# Altium project 2_Smoke_detector.PrjPcb (part 6 of 6)
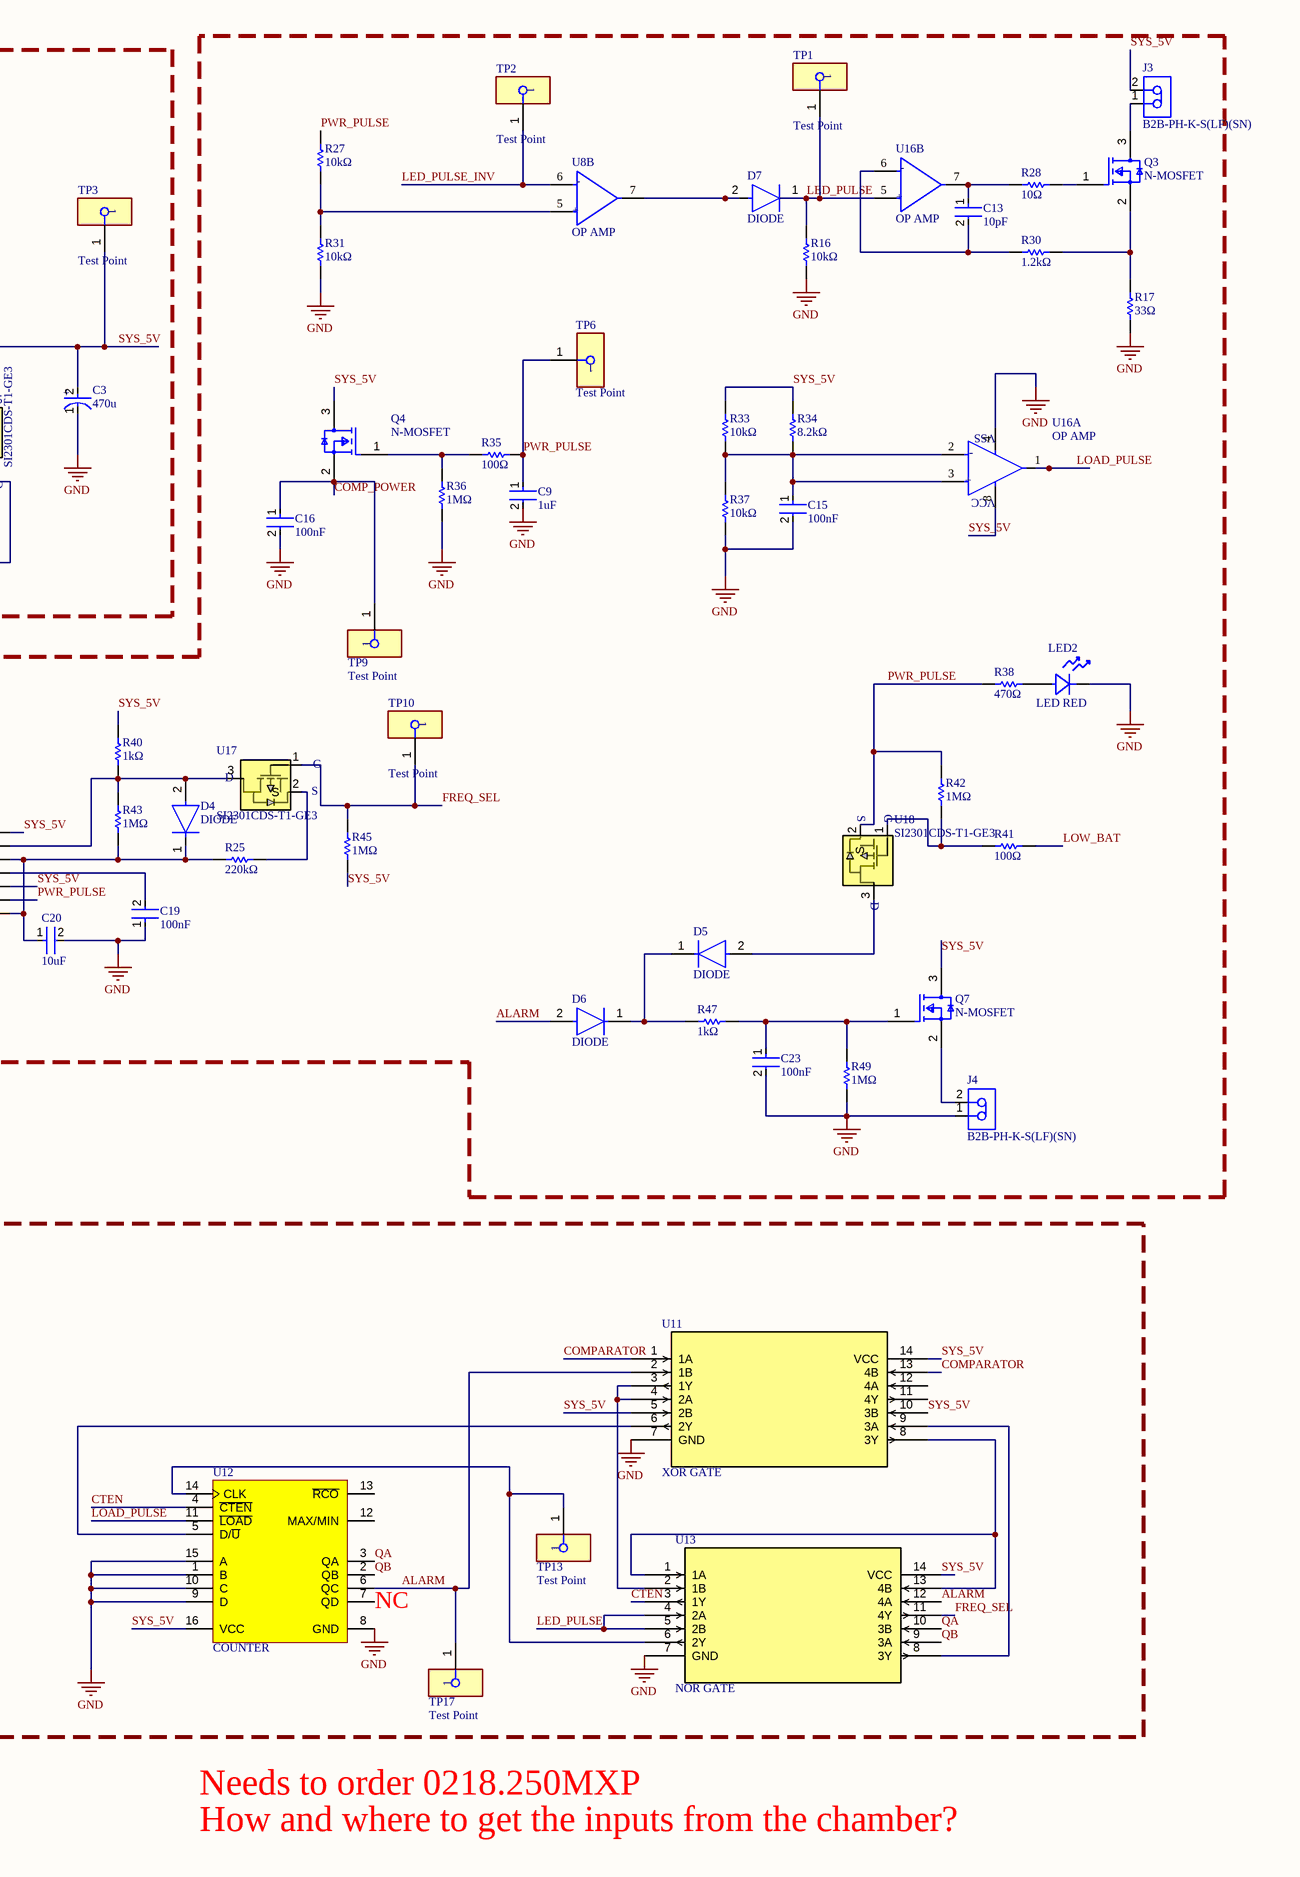
[diagram p6: 2_Smoke_detector.SchDoc, right]

## Sheet 2_Smoke_detector.SchDoc (continued)

### Library data of the parts (continued)
U12 = SN74HC191DR: IC BINARY COUNTER 4-BIT 16SOIC; Manufacturer: Texas Instruments; Manufacturer Lifecycle Status: ACTIVE; Clock Edge Trigger Type: Positive Edge; Direction: Bidirectional; Frequency: 48MHz; Max Supply Voltage: 6V; Min Supply Voltage: 2V; Number of Bits: 4; Number of Elements: 1; Operating Supply Voltage: 5V; Propagation Delay: 330ns; Sync/Async: Synchronous; Parameter 1: C484752; Supplier: Arrow Electronics; Supplier Part Number: C484752; Manufacturer Part Number: SN74HC191DR; RoHS: Compliant; Category: Counters; Stock: 558; Pricing: 1=0.3109, 10=0.3077, 25=0.3045, 100=0.3012, 250=0.298, 500=0.2948 (USD); Case/Package: SOIC; Height: 1.75mm; Lead Free: Lead Free; Length: 9.9mm; Lifecycle Status: Production; Logic Function: Counter; Max Operating Temperature: 85°C; Min Operating Temperature: -40°C; Mounting Technology: Surface Mount; Number of Bits per Element: 4; Pins: 16; Radiation Hardening: No; Schedule B: 8542390000, 8542390000|8542390000|8542390000|8542390000|8542390000; Thickness: 1.58mm; Turn-On Delay Time: 330ns; Weight: 141.690917mg; Width: 3.91mm; ComponentLink1URL: https://datasheet.octopart.com:443/SN74HC191DR-Texas-Instruments-datasheet-33033771.pdf?src-supplier=Texas+Instruments; ComponentLink1Description: https://datasheet.octopart.com:443/SN74HC191DR-Texas-Instruments-datasheet-33033771.pdf?src-supplier=Texas+Instruments; ComponentLink2URL: https://octopart.com:443/opatz8j6/c1?t=livQ8q43hWssvsTbIukJTl-bIiZFqHZ0_eG3ZISHFBGsaXj-6bBEoDG3PlwY2extO-X4vpm_CU7QLECDmgYzLGckRBw-Kbj8krgv4rmDK5yCwmDJ3CNVrP-qwPYpI0C_npVjETDCSzGdwJl8AedVD4--R_M23QxTnmHvlW1ezJkcgh_L1X-WuZU7RjpO56SQ3Zy_2CfdvVUvgApZvWencagwVo7xUZlWYvKblZWRwPqoRaIW_0nKcn1YlJgtddRiOWr6k4nRbeS5A28F22AkvDGS5XTih2WxDgVJofo11MXYRBHOIIfl1zg_UGo2ZSsVug4JVBZftDOiZiHXpjFkYXXcMh70ddjpxIu2AbTHTmViyoSqUNmmygbjeYWlvFqXFwPzDA&src-supplier=Texas+Instruments; ComponentLink2Description: https://octopart.com:443/opatz8j6/c1?t=livQ8q43hWssvsTbIukJTl-bIiZFqHZ0_eG3ZISHFBGsaXj-6bBEoDG3PlwY2extO-X4vpm_CU7QLECDmgYzLGckRBw-Kbj8krgv4rmDK5yCwmDJ3CNVrP-qwPYpI0C_npVjETDCSzGdwJl8AedVD4--R_M23QxTnmHvlW1ezJkcgh_L1X-WuZU7RjpO56SQ3Zy_2CfdvVUvgApZvWencagwVo7xUZlWYvKblZWRwPqoRaIW_0nKcn1YlJgtddRiOWr6k4nRbeS5A28F22AkvDGS5XTih2WxDgVJofo11MXYRBHOIIfl1zg_UGo2ZSsVug4JVBZftDOiZiHXpjFkYXXcMh70ddjpxIu2AbTHTmViyoSqUNmmygbjeYWlvFqXFwPzDA&src-supplier=Texas+Instruments; ComponentLink3URL: https://datasheet.octopart.com:443/SN74HC191DR-Texas-Instruments-datasheet-10254193.pdf?src-supplier=Texas+Instruments; ComponentLink3Description: https://datasheet.octopart.com:443/SN74HC191DR-Texas-Instruments-datasheet-10254193.pdf?src-supplier=Texas+Instruments; ComponentLink4URL: https://sigma.octopart.com:443/49249801/technical_drawing/Texas-Instruments-SN74HC191DR.pdf?src-supplier=Texas+Instruments; ComponentLink4Description: https://sigma.octopart.com:443/49249801/technical_drawing/Texas-Instruments-SN74HC191DR.pdf?src-supplier=Texas+Instruments; ComponentLink5URL: https://datasheet.octopart.com:443/SN74HC191DR-Texas-Instruments-datasheet-10253684.pdf?src-supplier=Texas+Instruments; ComponentLink5Description: https://datasheet.octopart.com:443/SN74HC191DR-Texas-Instruments-datasheet-10253684.pdf?src-supplier=Texas+Instruments; ComponentLink6URL: https://datasheet.octopart.com:443/SN74HC191DR-Texas-Instruments-datasheet-149727.pdf?src-supplier=Mouser; ComponentLink6Description: https://datasheet.octopart.com:443/SN74HC191DR-Texas-Instruments-datasheet-149727.pdf?src-supplier=Mouser; ComponentLink7URL: https://datasheet.octopart.com:443/SN74HC191DR-Texas-Instruments-datasheet-11538999.pdf?src-supplier=HQonline; ComponentLink7Description: https://datasheet.octopart.com:443/SN74HC191DR-Texas-Instruments-datasheet-11538999.pdf?src-supplier=HQonline; ComponentLink8URL: https://datasheet.octopart.com:443/SN74HC191DR-Texas-Instruments-datasheet-165804434.pdf?src-supplier=LCSC; ComponentLink8Description: https://datasheet.octopart.com:443/SN74HC191DR-Texas-Instruments-datasheet-165804434.pdf?src-supplier=LCSC; ComponentLink9URL: https://datasheet.octopart.com:443/SN74HC191DR-Texas-Instruments-datasheet-159116066.pdf?src-supplier=LCSC; ComponentLink9Description: https://datasheet.octopart.com:443/SN74HC191DR-Texas-Instruments-datasheet-159116066.pdf?src-supplier=LCSC; ComponentLink10URL: https://datasheet.octopart.com:443/SN74HC191DR-Texas-Instruments-datasheet-164417292.pdf?src-supplier=SHENGYU+ELECTRONICS; ComponentLink10Description: https://datasheet.octopart.com:443/SN74HC191DR-Texas-Instruments-datasheet-164417292.pdf?src-supplier=SHENGYU+ELECTRONICS; ComponentLink11URL: https://datasheet.octopart.com:443/SN74HC191DR-Texas-Instruments-datasheet-125515.pdf?src-supplier=DigiKey; ComponentLink11Description: https://datasheet.octopart.com:443/SN74HC191DR-Texas-Instruments-datasheet-125515.pdf?src-supplier=DigiKey; ComponentLink12URL: http://sigma.octopart.com:80/reach_statement/Texas-Instruments-company-64.pdf?src-supplier=Compliance+Statements; ComponentLink12Description: http://sigma.octopart.com:80/reach_statement/Texas-Instruments-company-64.pdf?src-supplier=Compliance+Statements; ComponentLink13URL: http://sigma.octopart.com:80/conflict_mineral_statement/Texas-Instruments-company-63.pdf?src-supplier=Compliance+Statements; ComponentLink13Description: http://sigma.octopart.com:80/conflict_mineral_statement/Texas-Instruments-company-63.pdf?src-supplier=Compliance+Statements; LCSC Part Number: C484752
U13 = 74HC02D,653: IC NOR 4-CIR 2-IN 14-SOIC; Manufacturer: Nexperia; Manufacturer Lifecycle Status: RELEASED FOR SUPPLY; High Level Output Current: -5.2mA; Load Capacitance: 50pF; Low Level Output Current: 4mA; Max Supply Current: 40µA; Max Supply Voltage: 6V; Min Supply Voltage: 2V; Nominal Supply Voltage (DC): 5V; Number of Channels: 4; Number of Input Lines: 2; Number of Output Lines: 1; Output Current: 5.2mA; Propagation Delay: 27ns; Quiescent Current: 2µA; Schmitt Trigger Input: No; Turn-On Delay Time: 7ns; Supplier: Future Electronics; Supplier Part Number: 74HC02D,653; Manufacturer Part Number: 74HC02D,653; RoHS: Compliant; Category: Logic Gates; Stock: 87500; Pricing: 2500=0.109, 5000=0.107, 10000=0.106, 37500=0.103 (USD); Case/Package: SOP; China RoHS: Compliant; Contact Plating: Gold; Country of Origin: Mainland China, Thailand; Export Control Classification Number (ECCN) Code: EAR99; Height - Seated (Max): 1.75mm; Harmonized Tariff Schedule (HTS) Code: 8542.39.00.01; Introduction Date: 1990-12-01; Lead Free: Lead Free; Length: 8.65mm; Lifecycle Status: Production; Logic Function: NOR; Max Operating Temperature: 125°C; Min Operating Temperature: -40°C; Mounting Technology: Surface Mount; Number of Circuits: 4; Number of Elements: 4; Number of Gates: 4; Number of Inputs: 2; Pins: 14; Number of Terminals: 14; Operating Supply Voltage: 5V; Radiation Hardening: No; REACH SVHC: Unaffected; Schedule B: 8542390000, 8542390000|8542390000|8542390000|8542390000|8542390000; Temperature Grade: Automotive; Terminal Pitch: 1.27mm; Voltage: 5V; Width: 3.9mm; ComponentLink1URL: https://datasheet.octopart.com:443/74HC02D%2C653-Nexperia-datasheet-87580166.pdf?src-supplier=IHS; ComponentLink1Description: https://datasheet.octopart.com:443/74HC02D%2C653-Nexperia-datasheet-87580166.pdf?src-supplier=IHS; ComponentLink2URL: https://datasheet.octopart.com:443/74HC02D%2C653-Nexperia-datasheet-59327597.pdf?src-supplier=Newark; ComponentLink2Description: https://datasheet.octopart.com:443/74HC02D%2C653-Nexperia-datasheet-59327597.pdf?src-supplier=Newark; ComponentLink3URL: https://datasheet.octopart.com:443/74HC02D%2C653-Nexperia-datasheet-11978307.pdf?src-supplier=element14+APAC; ComponentLink3Description: https://datasheet.octopart.com:443/74HC02D%2C653-Nexperia-datasheet-11978307.pdf?src-supplier=element14+APAC; ComponentLink4URL: https://datasheet.octopart.com:443/74HC02D%2C653-Nexperia-datasheet-5318266.pdf?src-supplier=Factory+Futures; ComponentLink4Description: https://datasheet.octopart.com:443/74HC02D%2C653-Nexperia-datasheet-5318266.pdf?src-supplier=Factory+Futures; ComponentLink5URL: https://datasheet.octopart.com:443/74HC02D%2C653-Nexperia-datasheet-160667651.pdf?src-supplier=Augswan; ComponentLink5Description: https://datasheet.octopart.com:443/74HC02D%2C653-Nexperia-datasheet-160667651.pdf?src-supplier=Augswan; ComponentLink6URL: https://datasheet.octopart.com:443/74HC02D%2C653-Nexperia-datasheet-180922420.pdf?src-supplier=TME; ComponentLink6Description: https://datasheet.octopart.com:443/74HC02D%2C653-Nexperia-datasheet-180922420.pdf?src-supplier=TME; ComponentLink7URL: http://sigma.octopart.com:80/reach_statement/NXP-Semiconductors-company-13.pdf?src-supplier=Compliance+Statements; ComponentLink7Description: http://sigma.octopart.com:80/reach_statement/NXP-Semiconductors-company-13.pdf?src-supplier=Compliance+Statements; ComponentLink8URL: http://sigma.octopart.com:80/rohs_statement/NXP-Semiconductors-company-12.pdf?src-supplier=Compliance+Statements; ComponentLink8Description: http://sigma.octopart.com:80/rohs_statement/NXP-Semiconductors-company-12.pdf?src-supplier=Compliance+Statements; LCSC Part Number: C5588
U15 = TLC556IDR: IC OSC TIMER DUAL 2.1MHZ 14-SOIC; Manufacturer: Texas Instruments; Manufacturer Lifecycle Status: ACTIVE; High Level Output Current: -10mA; Low Level Output Current: 100mA; Max Power Dissipation: 950mW; Max Supply Voltage: 18V; Min Supply Voltage: 3V; Nominal Supply Current: 130µA; Number of Timers/Counters: 2; Operating Supply Current: 720µA; Supplier: Arrow Electronics; Supplier Part Number: TLC556IDR; Manufacturer Part Number: TLC556IDR; RoHS: Compliant; Category: Timers and Oscillators; Stock: 973; Pricing: 1=1.3938, 10=1.0552, 25=0.9641, 100=0.8647, 250=0.8042, 500=0.7847 (USD); Case/Package: SOIC; Contact Plating: Gold; Frequency: 2.1MHz; Height: 0m; Lead Free: Lead Free; Length: 8.65mm; Lifecycle Status: Production; Max Operating Temperature: 85°C; Min Operating Temperature: -40°C; Mounting Technology: Surface Mount; Pins: 14; Power Dissipation: 950mW; Quiescent Current: 130µA; Radiation Hardening: No; Schedule B: 8542390000, 8542390000|8542390000, 8542390000|8542390000|8542390000, 8542390000|8542390000|8542390000|8542390000; Thickness: 1.58mm; Weight: 122.413241mg; Width: 3.91mm; ComponentLink1URL: https://sigma.octopart.com:443/182471030/technical_drawing/Texas-Instruments-TLC556IDR.pdf?src-supplier=Texas+Instruments; ComponentLink1Description: https://sigma.octopart.com:443/182471030/technical_drawing/Texas-Instruments-TLC556IDR.pdf?src-supplier=Texas+Instruments; ComponentLink2URL: https://octopart.com:443/opatz8j6/c1?t=wVb5vgt0zPQWKkF67eX7szHFu9eke679Os8KuuvsewqxubaA68h0RbxCTMV96P98jOA947BI5otjYLTO8NlJcm-sT0EwftDyiu21Zrbb2619OTaKXxEY5gqfTVo9yQc5eHmsnO_NjjO9pry39XW7zVwp5JZvYUuFi7CEvLfZBwXUvv5oJGvho0j5oLGTrHUekUSs9TZpc4u8Hs0dZvilMkIXoCg4ZsBkHlIICA4YDxdwRjADArPrk9usKJbDjqGpujKb6DUgPPp-5b6DXLWwp_NVSyXgaG7FrrCxwcsuC9e6EGdk3LvSbo4Poq0m1Apd1KwtZX406OXT8Kt7TXRfkPYmF30X_4theIHGy8QB6ScxhVB1SWES0wyhplT5iwiCIeo&src-supplier=Texas+Instruments; ComponentLink2Description: https://octopart.com:443/opatz8j6/c1?t=wVb5vgt0zPQWKkF67eX7szHFu9eke679Os8KuuvsewqxubaA68h0RbxCTMV96P98jOA947BI5otjYLTO8NlJcm-sT0EwftDyiu21Zrbb2619OTaKXxEY5gqfTVo9yQc5eHmsnO_NjjO9pry39XW7zVwp5JZvYUuFi7CEvLfZBwXUvv5oJGvho0j5oLGTrHUekUSs9TZpc4u8Hs0dZvilMkIXoCg4ZsBkHlIICA4YDxdwRjADArPrk9usKJbDjqGpujKb6DUgPPp-5b6DXLWwp_NVSyXgaG7FrrCxwcsuC9e6EGdk3LvSbo4Poq0m1Apd1KwtZX406OXT8Kt7TXRfkPYmF30X_4theIHGy8QB6ScxhVB1SWES0wyhplT5iwiCIeo&src-supplier=Texas+Instruments; ComponentLink3URL: https://datasheet.octopart.com:443/TLC556IDR-Texas-Instruments-datasheet-32026760.pdf?src-supplier=Texas+Instruments; ComponentLink3Description: https://datasheet.octopart.com:443/TLC556IDR-Texas-Instruments-datasheet-32026760.pdf?src-supplier=Texas+Instruments; ComponentLink4URL: https://datasheet.octopart.com:443/TLC556IDR-Texas-Instruments-datasheet-10255761.pdf?src-supplier=Texas+Instruments; ComponentLink4Description: https://datasheet.octopart.com:443/TLC556IDR-Texas-Instruments-datasheet-10255761.pdf?src-supplier=Texas+Instruments; ComponentLink5URL: https://sigma.octopart.com:443/49249646/technical_drawing/Texas-Instruments-TLC556IDR.pdf?src-supplier=Texas+Instruments; ComponentLink5Description: https://sigma.octopart.com:443/49249646/technical_drawing/Texas-Instruments-TLC556IDR.pdf?src-supplier=Texas+Instruments; ComponentLink6URL: https://datasheet.octopart.com:443/TLC556IDR-Texas-Instruments-datasheet-149920.pdf?src-supplier=Texas+Instruments; ComponentLink6Description: https://datasheet.octopart.com:443/TLC556IDR-Texas-Instruments-datasheet-149920.pdf?src-supplier=Texas+Instruments; ComponentLink7URL: https://datasheet.octopart.com:443/TLC556IDR-Texas-Instruments-datasheet-14363887.pdf?src-supplier=HQonline; ComponentLink7Description: https://datasheet.octopart.com:443/TLC556IDR-Texas-Instruments-datasheet-14363887.pdf?src-supplier=HQonline; ComponentLink8URL: https://datasheet.octopart.com:443/TLC556IDR-Texas-Instruments-datasheet-164411896.pdf?src-supplier=LCSC; ComponentLink8Description: https://datasheet.octopart.com:443/TLC556IDR-Texas-Instruments-datasheet-164411896.pdf?src-supplier=LCSC; ComponentLink9URL: https://datasheet.octopart.com:443/TLC556IDR-Texas-Instruments-datasheet-159117753.pdf?src-supplier=LCSC; ComponentLink9Description: https://datasheet.octopart.com:443/TLC556IDR-Texas-Instruments-datasheet-159117753.pdf?src-supplier=LCSC; ComponentLink10URL: https://datasheet.octopart.com:443/TLC556IDR-Texas-Instruments-datasheet-66581719.pdf?src-supplier=Newark; ComponentLink10Description: https://datasheet.octopart.com:443/TLC556IDR-Texas-Instruments-datasheet-66581719.pdf?src-supplier=Newark; ComponentLink11URL: https://datasheet.octopart.com:443/TLC556IDR-Texas-Instruments-datasheet-11637363.pdf?src-supplier=Arrow+Electronics; ComponentLink11Description: https://datasheet.octopart.com:443/TLC556IDR-Texas-Instruments-datasheet-11637363.pdf?src-supplier=Arrow+Electronics; ComponentLink12URL: https://datasheet.octopart.com:443/TLC556IDR-Texas-Instruments-datasheet-13614.pdf?src-supplier=DigiKey; ComponentLink12Description: https://datasheet.octopart.com:443/TLC556IDR-Texas-Instruments-datasheet-13614.pdf?src-supplier=DigiKey; ComponentLink13URL: http://sigma.octopart.com:80/reach_statement/Texas-Instruments-company-64.pdf?src-supplier=Compliance+Statements; ComponentLink13Description: http://sigma.octopart.com:80/reach_statement/Texas-Instruments-company-64.pdf?src-supplier=Compliance+Statements; ComponentLink14URL: http://sigma.octopart.com:80/conflict_mineral_statement/Texas-Instruments-company-63.pdf?src-supplier=Compliance+Statements; ComponentLink14Description: http://sigma.octopart.com:80/conflict_mineral_statement/Texas-Instruments-company-63.pdf?src-supplier=Compliance+Statements; LCSC Part Number: C85051
U19 = 3314G-1-503E: TRIMMER 50K OHM 0.25W GW TOP ADJ; Manufacturer_Name: Bourns Electronics; Copyright: Copyright (C) 2025 Ultra Librarian. All rights reserved.; Manufacturer_Part_Number: 3314G-1-503E; RefDes: RefDes; Type: Type; LCSC Part number: C719184
V1 = V275LA20AP: VARISTOR 430V 4.5KA DISC 14MM; Manufacturer_Name: Littelfuse Inc; Copyright: Copyright (C) 2025 Ultra Librarian. All rights reserved.; Manufacturer_Part_Number: V275LA20AP; LCSC Part Number: C70419